# Altium project led_matrix_serial.PrjPcb
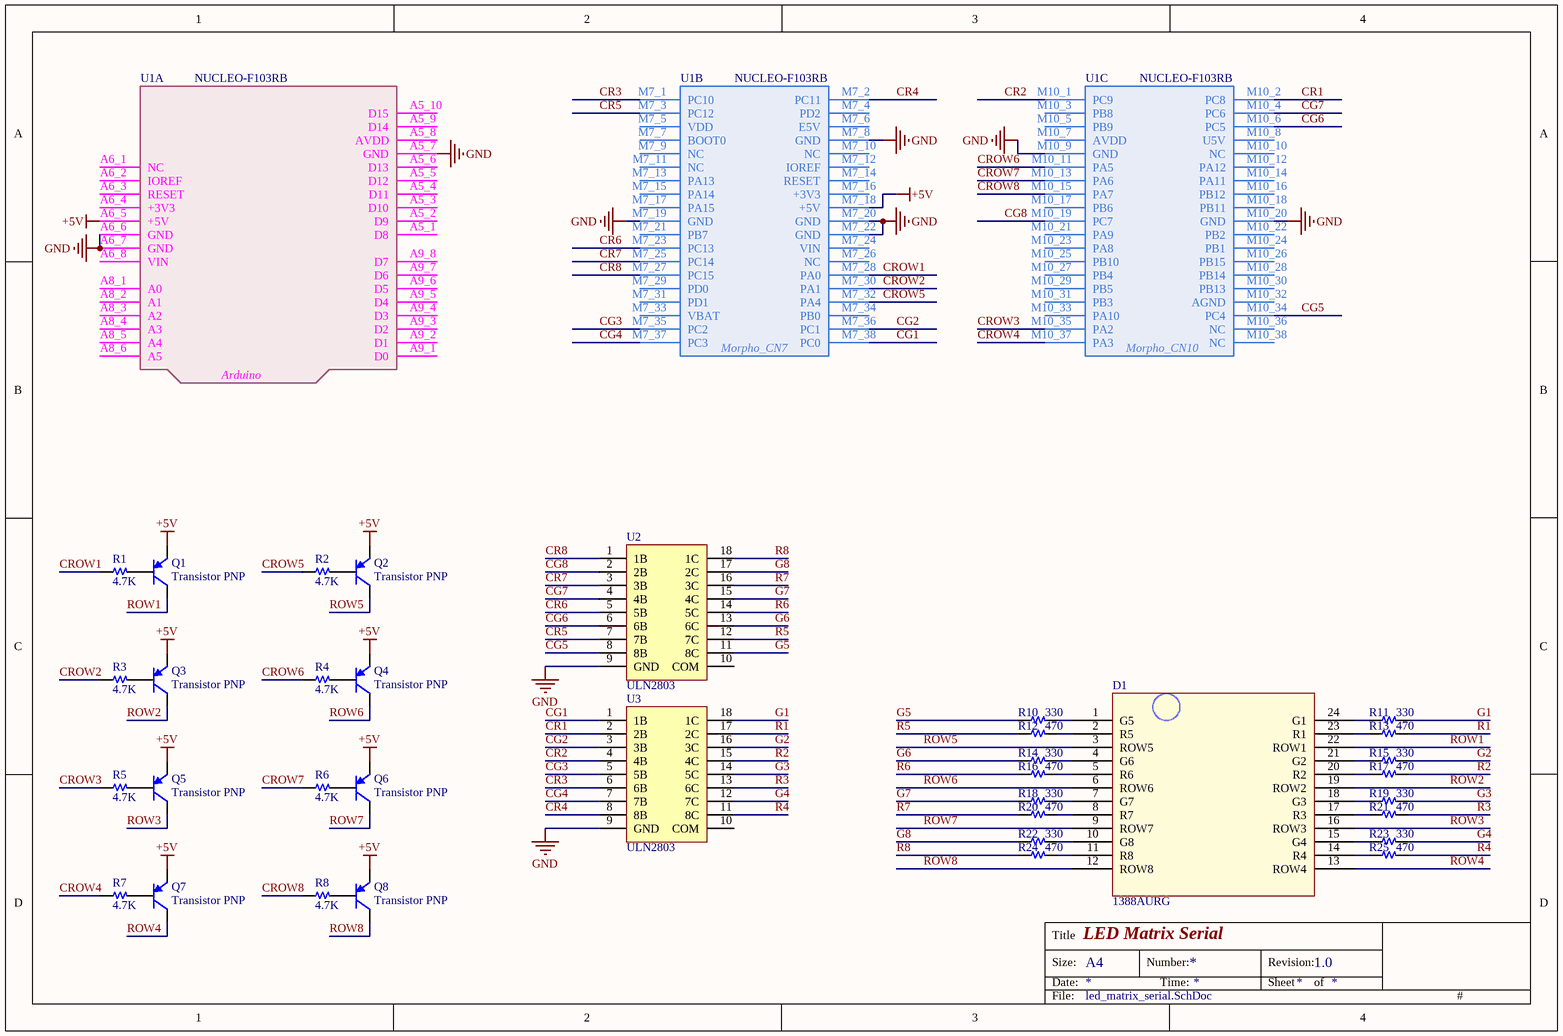
[diagram p0: led_matrix_serial.SchDoc]
ProjectTitle: LED Matrix Serial; Version: 1.0
1 sheet, 36 parts. Net scope: global (net labels, ports and power ports of the same name join across sheets).
Board file: led_matrix_serial.PcbDoc

## Sheet led_matrix_serial.SchDoc
size A4; DocumentNumber: 1; SheetNumber: 1; SheetTotal: 1

### Parts
D1  1388AURG  [LED/MATRIX/1388]
Q1  Transistor PNP  [SOT-23]
Q2  Transistor PNP  [SOT-23]
Q3  Transistor PNP  [SOT-23]
Q4  Transistor PNP  [SOT-23]
Q5  Transistor PNP  [SOT-23]
Q6  Transistor PNP  [SOT-23]
Q7  Transistor PNP  [SOT-23]
Q8  Transistor PNP  [SOT-23]
R1  4.7K  [R 0805]
R2  4.7K  [R 0805]
R3  4.7K  [R 0805]
R4  4.7K  [R 0805]
R5  4.7K  [R 0805]
R6  4.7K  [R 0805]
R7  4.7K  [R 0805]
R8  4.7K  [R 0805]
R10  330  [R 0805]
R11  330  [R 0805]
R12  470  [R 0805]
R13  470  [R 0805]
R14  330  [R 0805]
R15  330  [R 0805]
R16  470  [R 0805]
R17  470  [R 0805]
R18  330  [R 0805]
R19  330  [R 0805]
R20  470  [R 0805]
R21  470  [R 0805]
R22  330  [R 0805]
R23  330  [R 0805]
R24  470  [R 0805]
R25  470  [R 0805]
U1  NUCLEO-F103RB  [NUCLEO]  (parts A,B,C of 3)
U2  ULN2803  [SOP 18 50p]
U3  ULN2803  [SOP 18 50p]

### Nets
+5V: Q1.2(E) Q2.2(E) Q3.2(E) Q4.2(E) Q5.2(E) Q6.2(E) Q7.2(E) Q8.2(E) U1.A6_5(+5V) U1.M7_18(+5V)
GND: U1.A5_7(GND) U1.A6_6(GND) U1.A6_7(GND) U1.M7_8(GND) U1.M7_19(GND) U1.M7_20(GND) U1.M7_22(GND) U1.M10_9(GND) U1.M10_20(GND) U2.9(GND) U3.9(GND)
CG1: U1.M7_38(PC0) U3.1(1B)
CG2: U1.M7_36(PC1) U3.3(3B)
CG3: U1.M7_35(PC2) U3.5(5B)
CG4: U1.M7_37(PC3) U3.7(7B)
CG5: U1.M10_34(PC4) U2.8(8B)
CG6: U1.M10_6(PC5) U2.6(6B)
CG7: U1.M10_4(PC6) U2.4(4B)
CG8: U1.M10_19(PC7) U2.2(2B)
CR1: U1.M10_2(PC8) U3.2(2B)
CR2: U1.M10_1(PC9) U3.4(4B)
CR3: U1.M7_1(PC10) U3.6(6B)
CR4: U1.M7_2(PC11) U3.8(8B)
CR5: U1.M7_3(PC12) U2.7(7B)
CR6: U1.M7_23(PC13) U2.5(5B)
CR7: U1.M7_25(PC14) U2.3(3B)
CR8: U1.M7_27(PC15) U2.1(1B)
CROW1: R1.1 U1.M7_28(PA0)
CROW2: R3.1 U1.M7_30(PA1)
CROW3: R5.1 U1.M10_35(PA2)
CROW4: R7.1 U1.M10_37(PA3)
CROW5: R2.1 U1.M7_32(PA4)
CROW6: R4.1 U1.M10_11(PA5)
CROW7: R6.1 U1.M10_13(PA6)
CROW8: R8.1 U1.M10_15(PA7)
G1: R11.2 U3.18(1C)
G2: R15.2 U3.16(3C)
G3: R19.2 U3.14(5C)
G4: R23.2 U3.12(7C)
G5: R10.1 U2.11(8C)
G6: R14.1 U2.13(6C)
G7: R18.1 U2.15(4C)
G8: R22.1 U2.17(2C)
R1: R13.2 U3.17(2C)
R2: R17.2 U3.15(4C)
R3: R21.2 U3.13(6C)
R4: R25.2 U3.11(8C)
R5: R12.1 U2.12(7C)
R6: R16.1 U2.14(5C)
R7: R20.1 U2.16(3C)
R8: R24.1 U2.18(1C)
ROW1: D1.22(ROW1) Q1.3(C)
ROW2: D1.19(ROW2) Q3.3(C)
ROW3: D1.16(ROW3) Q5.3(C)
ROW4: D1.13(ROW4) Q7.3(C)
ROW5: D1.3(ROW5) Q2.3(C)
ROW6: D1.6(ROW6) Q4.3(C)
ROW7: D1.9(ROW7) Q6.3(C)
ROW8: D1.12(ROW8) Q8.3(C)
NetD1_1: D1.1(G5) R10.2
NetD1_2: D1.2(R5) R12.2
NetD1_4: D1.4(G6) R14.2
NetD1_5: D1.5(R6) R16.2
NetD1_7: D1.7(G7) R18.2
NetD1_8: D1.8(R7) R20.2
NetD1_10: D1.10(G8) R22.2
NetD1_11: D1.11(R8) R24.2
NetD1_14: D1.14(R4) R25.1
NetD1_15: D1.15(G4) R23.1
NetD1_17: D1.17(R3) R21.1
NetD1_18: D1.18(G3) R19.1
NetD1_20: D1.20(R2) R17.1
NetD1_21: D1.21(G2) R15.1
NetD1_23: D1.23(R1) R13.1
NetD1_24: D1.24(G1) R11.1
NetQ1_1: Q1.1(B) R1.2
NetQ2_1: Q2.1(B) R2.2
NetQ3_1: Q3.1(B) R3.2
NetQ4_1: Q4.1(B) R4.2
NetQ5_1: Q5.1(B) R5.2
NetQ6_1: Q6.1(B) R6.2
NetQ7_1: Q7.1(B) R7.2
NetQ8_1: Q8.1(B) R8.2

Not connected (* = marked no-connect by the designer): U1 A5_1(D8) A5_2(D9) A5_3(D10) A5_4(D11) A5_5(D12) A5_6(D13) A5_8(AVDD) A5_9(D14) A5_10(D15) A6_1(NC) A6_2(IOREF) A6_3(RESET) A6_4(+3V3) A6_8(VIN) A8_1(A0) A8_2(A1) A8_3(A2) A8_4(A3) A8_5(A4) A8_6(A5) A9_1(D0) A9_2(D1) A9_3(D2) A9_4(D3) A9_5(D4) A9_6(D5) A9_7(D6) A9_8(D7) M7_4(PD2) M7_5(VDD) M7_6(E5V) M7_7(BOOT0) M7_9(NC) M7_10(NC) M7_11(NC) M7_12(IOREF) M7_13(PA13) M7_14(RESET) M7_15(PA14) M7_16(+3V3) M7_17(PA15) M7_21(PB7) M7_24(VIN) M7_26(NC) M7_29(PD0) M7_31(PD1) M7_33(VBAT) M7_34(PB0) M10_3(PB8) M10_5(PB9) M10_7(AVDD) M10_8(U5V) M10_10(NC) M10_12(PA12) M10_14(PA11) M10_16(PB12) M10_17(PB6) M10_18(PB11) M10_21(PA9) M10_22(PB2) M10_23(PA8) M10_24(PB1) M10_25(PB10) M10_26(PB15) M10_27(PB4) M10_28(PB14) M10_29(PB5) M10_30(PB13) M10_31(PB3) M10_32(AGND) M10_33(PA10) M10_36(NC) M10_38(NC); U2 10(COM); U3 10(COM)

### Notes on the sheet
- Title
- Size:
- Date:
- A4
- Number:
- Time:
- *
- Revision:
- Sheet
- of
- File:
- #
- (in symbol NUCLEO-F103RB, part A) Arduino
- (in symbol NUCLEO-F103RB, part B) Morpho_CN7
- (in symbol NUCLEO-F103RB, part C) Morpho_CN10

### Library data of the parts
D1 = LED MATRIX 1388AURG: 1388AURG, Common-Anode, LED Matrix 8x8, RED-GREEN, 32x32mm
Q1-Q8 = Transistor PNP: PNP Bipolar Transistor
R1-R8 R10-R25 = Resistor
U1 = NUCLEO-F103RB: STM32F103RB, mbed-Enabled Development Nucleo-64 STM32F1 ARM® Cortex®-M3 MCU 32-Bit Embedded Evaluation Board; Manufacturer: STMicroelectronics; Manufacturer Product Number: NUCLEO-F103RB; BRAND: STMicroelectronics; PART NO: NUCLEO-F103RB; STOCK CODE: 497-14362-ND; SUPPLIER: digi-key; TYPE: EVAL BRD
U2 U3 = ULN2803: TRANS 8NPN DARL 50V 0.5A 18SO; PART NO: ULN2803ADWR; BRAND: TI; PACKAGE: 18-SOIC; STOCK CODE: 296-15777-1-ND; SUPPLIER: Digi-Key; TYPE: SMD